# Altium schematic sheet Connectors.SchDoc
size A2
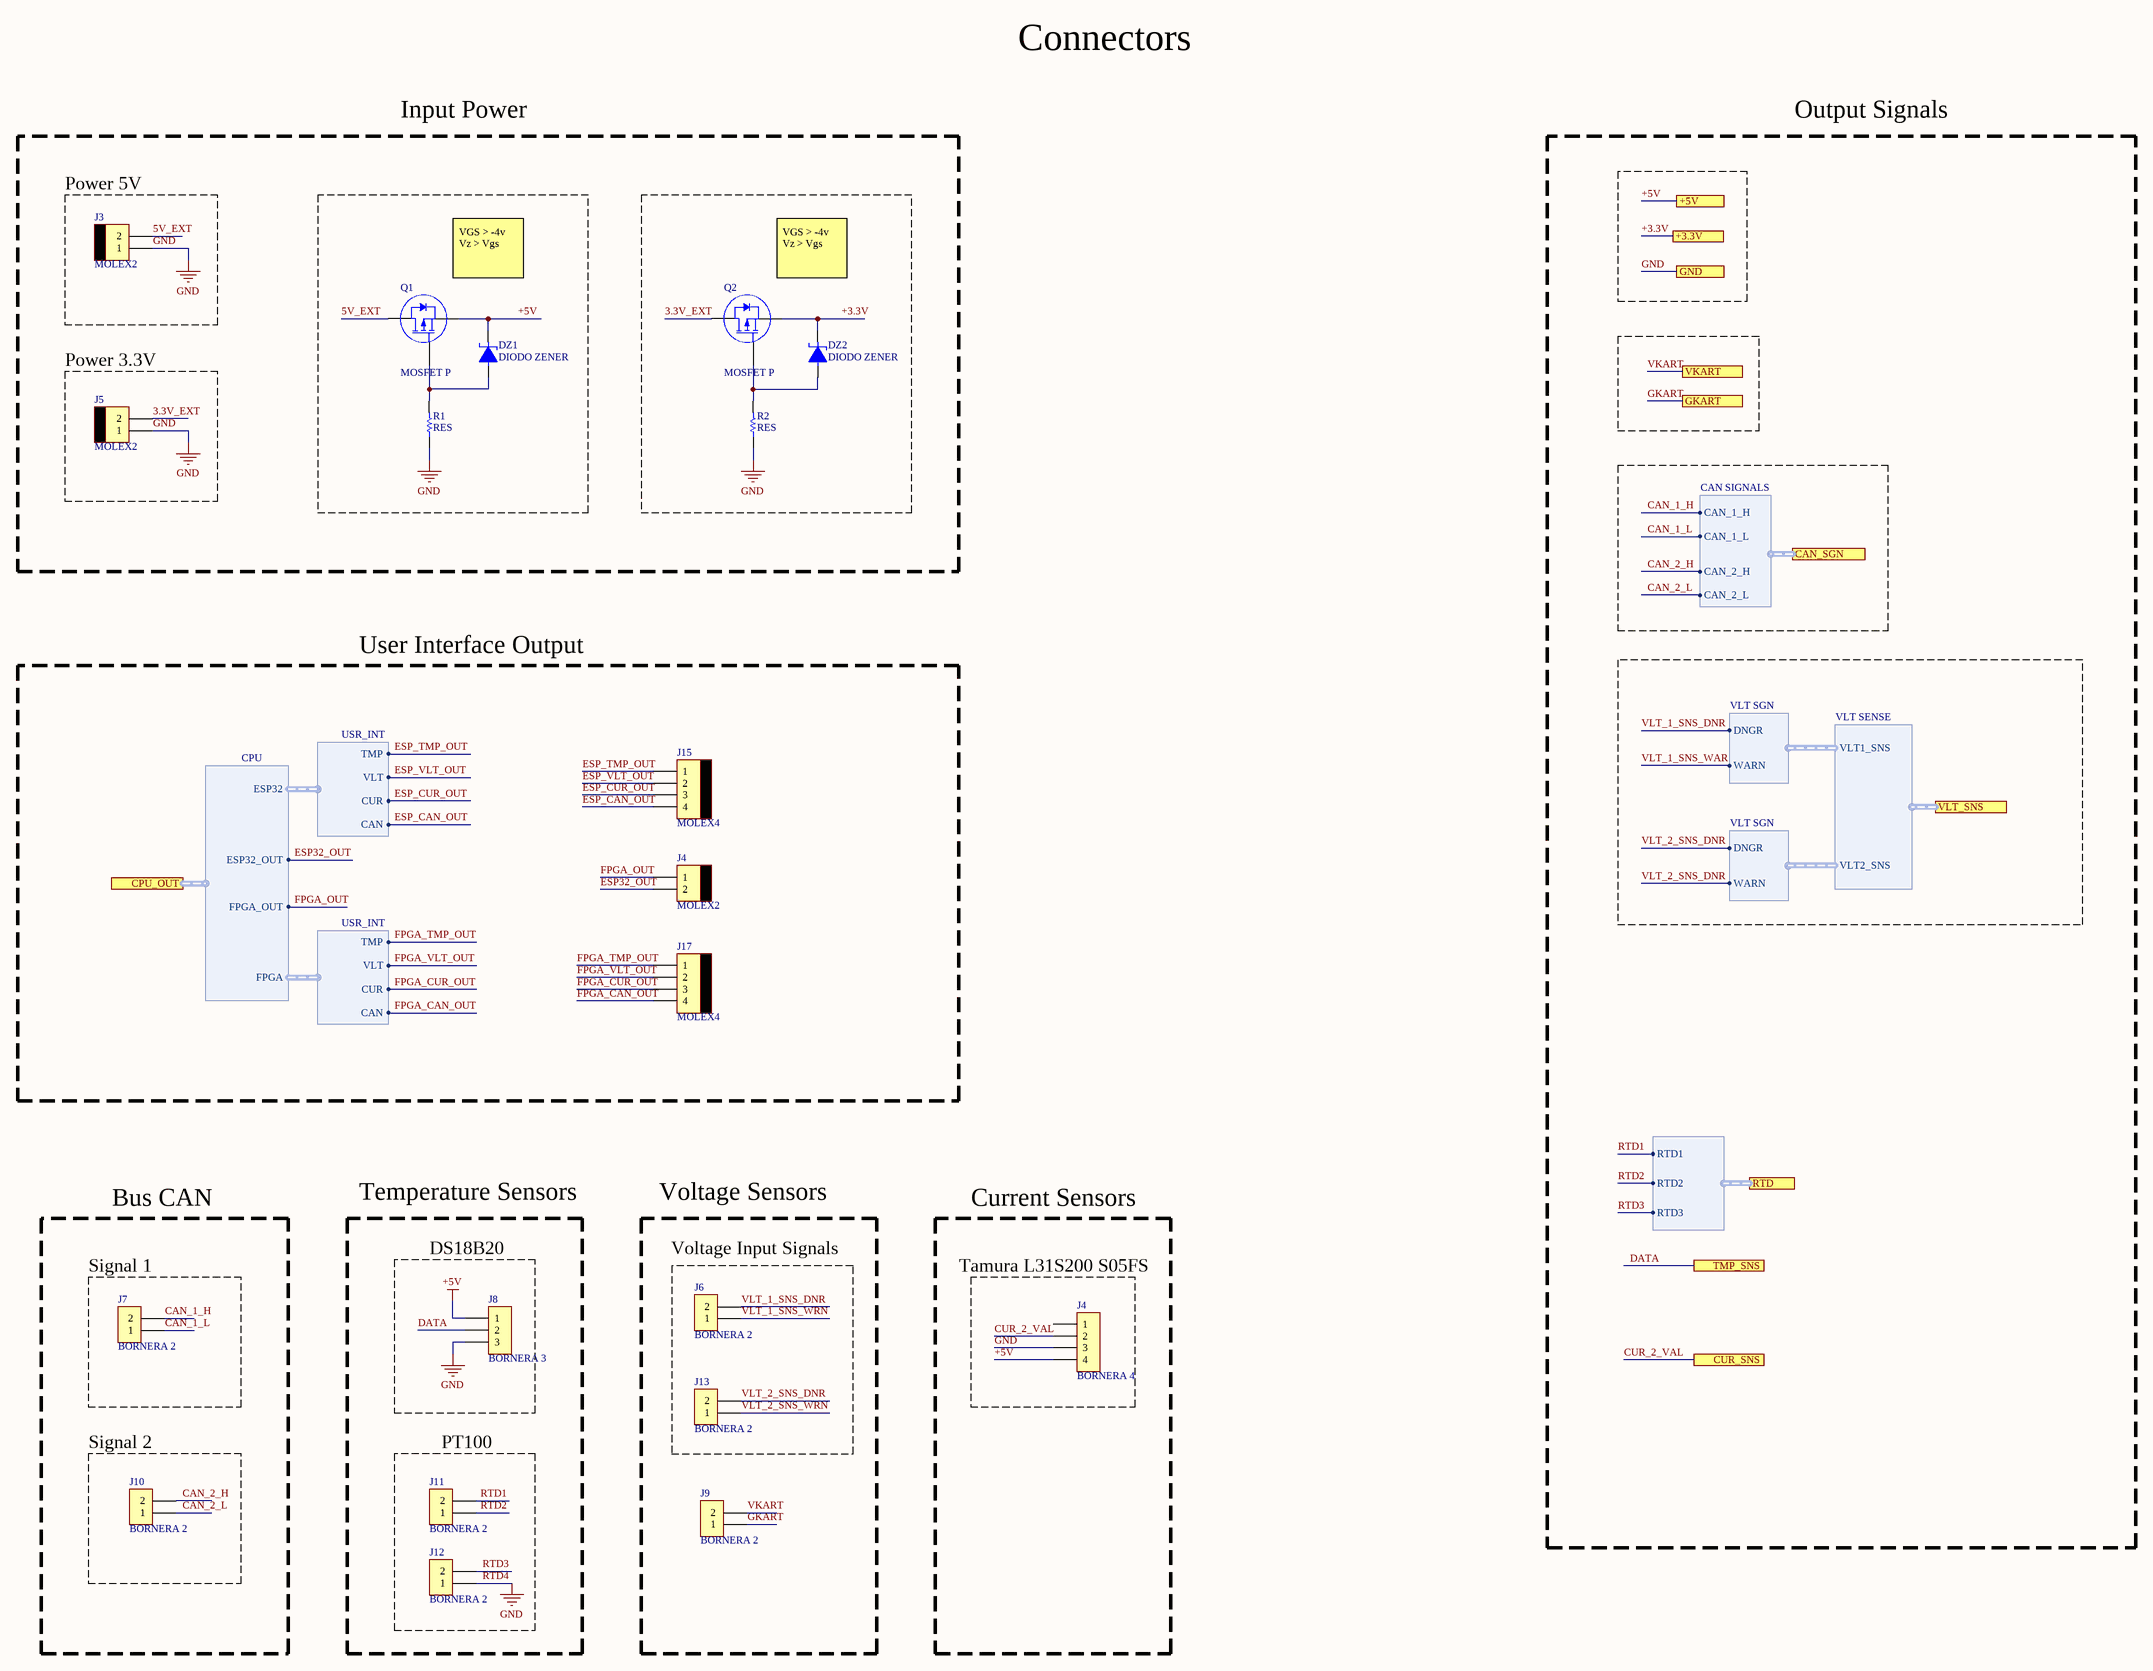
[diagram p0: Connectors.SchDoc]

## Parts
(Parts that share a designator on the sheet are numbered #1, #2 ... from top to bottom, then left to right.)
DZ1  DIODO ZENER  [DO41]
DZ2  DIODO ZENER  [DO41]
J3  MOLEX2  [MOLEX2]
J4#1  MOLEX2  [MOLEX2]
J4#2  BORNERA 4  [BORNERA4]
J5  MOLEX2  [MOLEX2]
J6  BORNERA 2  [BORNERA2]
J7  BORNERA 2  [BORNERA2]
J8  BORNERA 3  [BORNERA3]
J9  BORNERA 2  [BORNERA2]
J10  BORNERA 2  [BORNERA2]
J11  BORNERA 2  [BORNERA2]
J12  BORNERA 2  [BORNERA2]
J13  BORNERA 2  [BORNERA2]
J15  MOLEX4  [MOLEX4]
J17  MOLEX4  [MOLEX4]
Q1  MOSFET P  [TO-220 V]
Q2  MOSFET P  [TO-220 V]
R1  RES  [RES400]
R2  RES  [RES400]

## Blocks framed on the sheet
Input Power: DZ1 DZ2 Q1 Q2 R1 R2
Power 5V: J3
Power 3.3V: J5
User Interface Output: J4#1 J15 J17
Voltage Sensors: J9
Current Sensors: J4#2
Signal 1: J7
DS18B20: J8
Voltage Input Signals: J6 J13
Signal 2: J10
PT100: J11 J12

## Ports
+3.3V, +5V, CAN_SGN (harness CAN SIGNALS), CPU_OUT (harness CPU), CUR_SNS, GKART, GND, RTD (harness *), TMP_SNS, VKART, VLT_SNS (harness VLT SENSE)

## Harnesses
?: RTD1, RTD2, RTD3
CAN SIGNALS: CAN_1_H, CAN_1_L, CAN_2_H, CAN_2_L
VLT SGN: DNGR, WARN
USR_INT: CUR, VLT, TMP, CAN
CPU: FPGA, ESP32, ESP32_OUT, FPGA_OUT
VLT SENSE: VLT1_SNS, VLT2_SNS

## Nets
+5V: DZ1.2 J4#2.4 J8.1 Q1.3(S) ; port +5V
GND: J3.1 J4#2.3 J5.1 J8.3 J12.1 R1.1 R2.1 ; port GND  [also labelled RTD4]
3.3V_EXT: J5.2 Q2.2(D)
5V_EXT: J3.2 Q1.2(D)
+3.3V: DZ2.2 Q2.3(S) ; port +3.3V
CAN_1_H: J7.2 ; port CAN_SGN.CAN_1_H
CAN_1_L: J7.1 ; port CAN_SGN.CAN_1_L
CAN_2_H: J10.2 ; port CAN_SGN.CAN_2_H
CAN_2_L: J10.1 ; port CAN_SGN.CAN_2_L
CUR_2_VAL: J4#2.2 ; port CUR_SNS
DATA: J8.2 ; port TMP_SNS
ESP32_OUT: J4#1.2
ESP_CAN_OUT: J15.4 ; harness USR_INT.CAN
ESP_CUR_OUT: J15.3 ; harness USR_INT.CUR
ESP_TMP_OUT: J15.1 ; harness USR_INT.TMP
ESP_VLT_OUT: J15.2 ; harness USR_INT.VLT
FPGA_CAN_OUT: J17.4 ; harness USR_INT.CAN
FPGA_CUR_OUT: J17.3 ; harness USR_INT.CUR
FPGA_OUT: J4#1.1
FPGA_TMP_OUT: J17.1 ; harness USR_INT.TMP
FPGA_VLT_OUT: J17.2 ; harness USR_INT.VLT
GKART: J9.1 ; port GKART
RTD1: J11.2 ; port RTD.RTD1
RTD2: J11.1 ; port RTD.RTD2
RTD3: J12.2 ; port RTD.RTD3
VKART: J9.2 ; port VKART
VLT_1_SNS_DNR: J6.2 ; harness VLT SGN.DNGR
VLT_1_SNS_WAR: harness VLT SGN.WARN
VLT_1_SNS_WRN: J6.1
VLT_2_SNS_DNR: J13.2 ; harness VLT SGN.DNGR, harness VLT SGN.WARN
VLT_2_SNS_WRN: J13.1
NetDZ1_1: DZ1.1 Q1.1(G) R1.2
NetDZ2_1: DZ2.1 Q2.1(G) R2.2

Not connected (* = marked no-connect by the designer): J4#2 1

## Notes on the sheet
- Connectors
- Output Signals
- VGS > -4v
  Vz > Vgs
- Bus CAN
- Temperature Sensors
- Tamura L31S200 S05FS